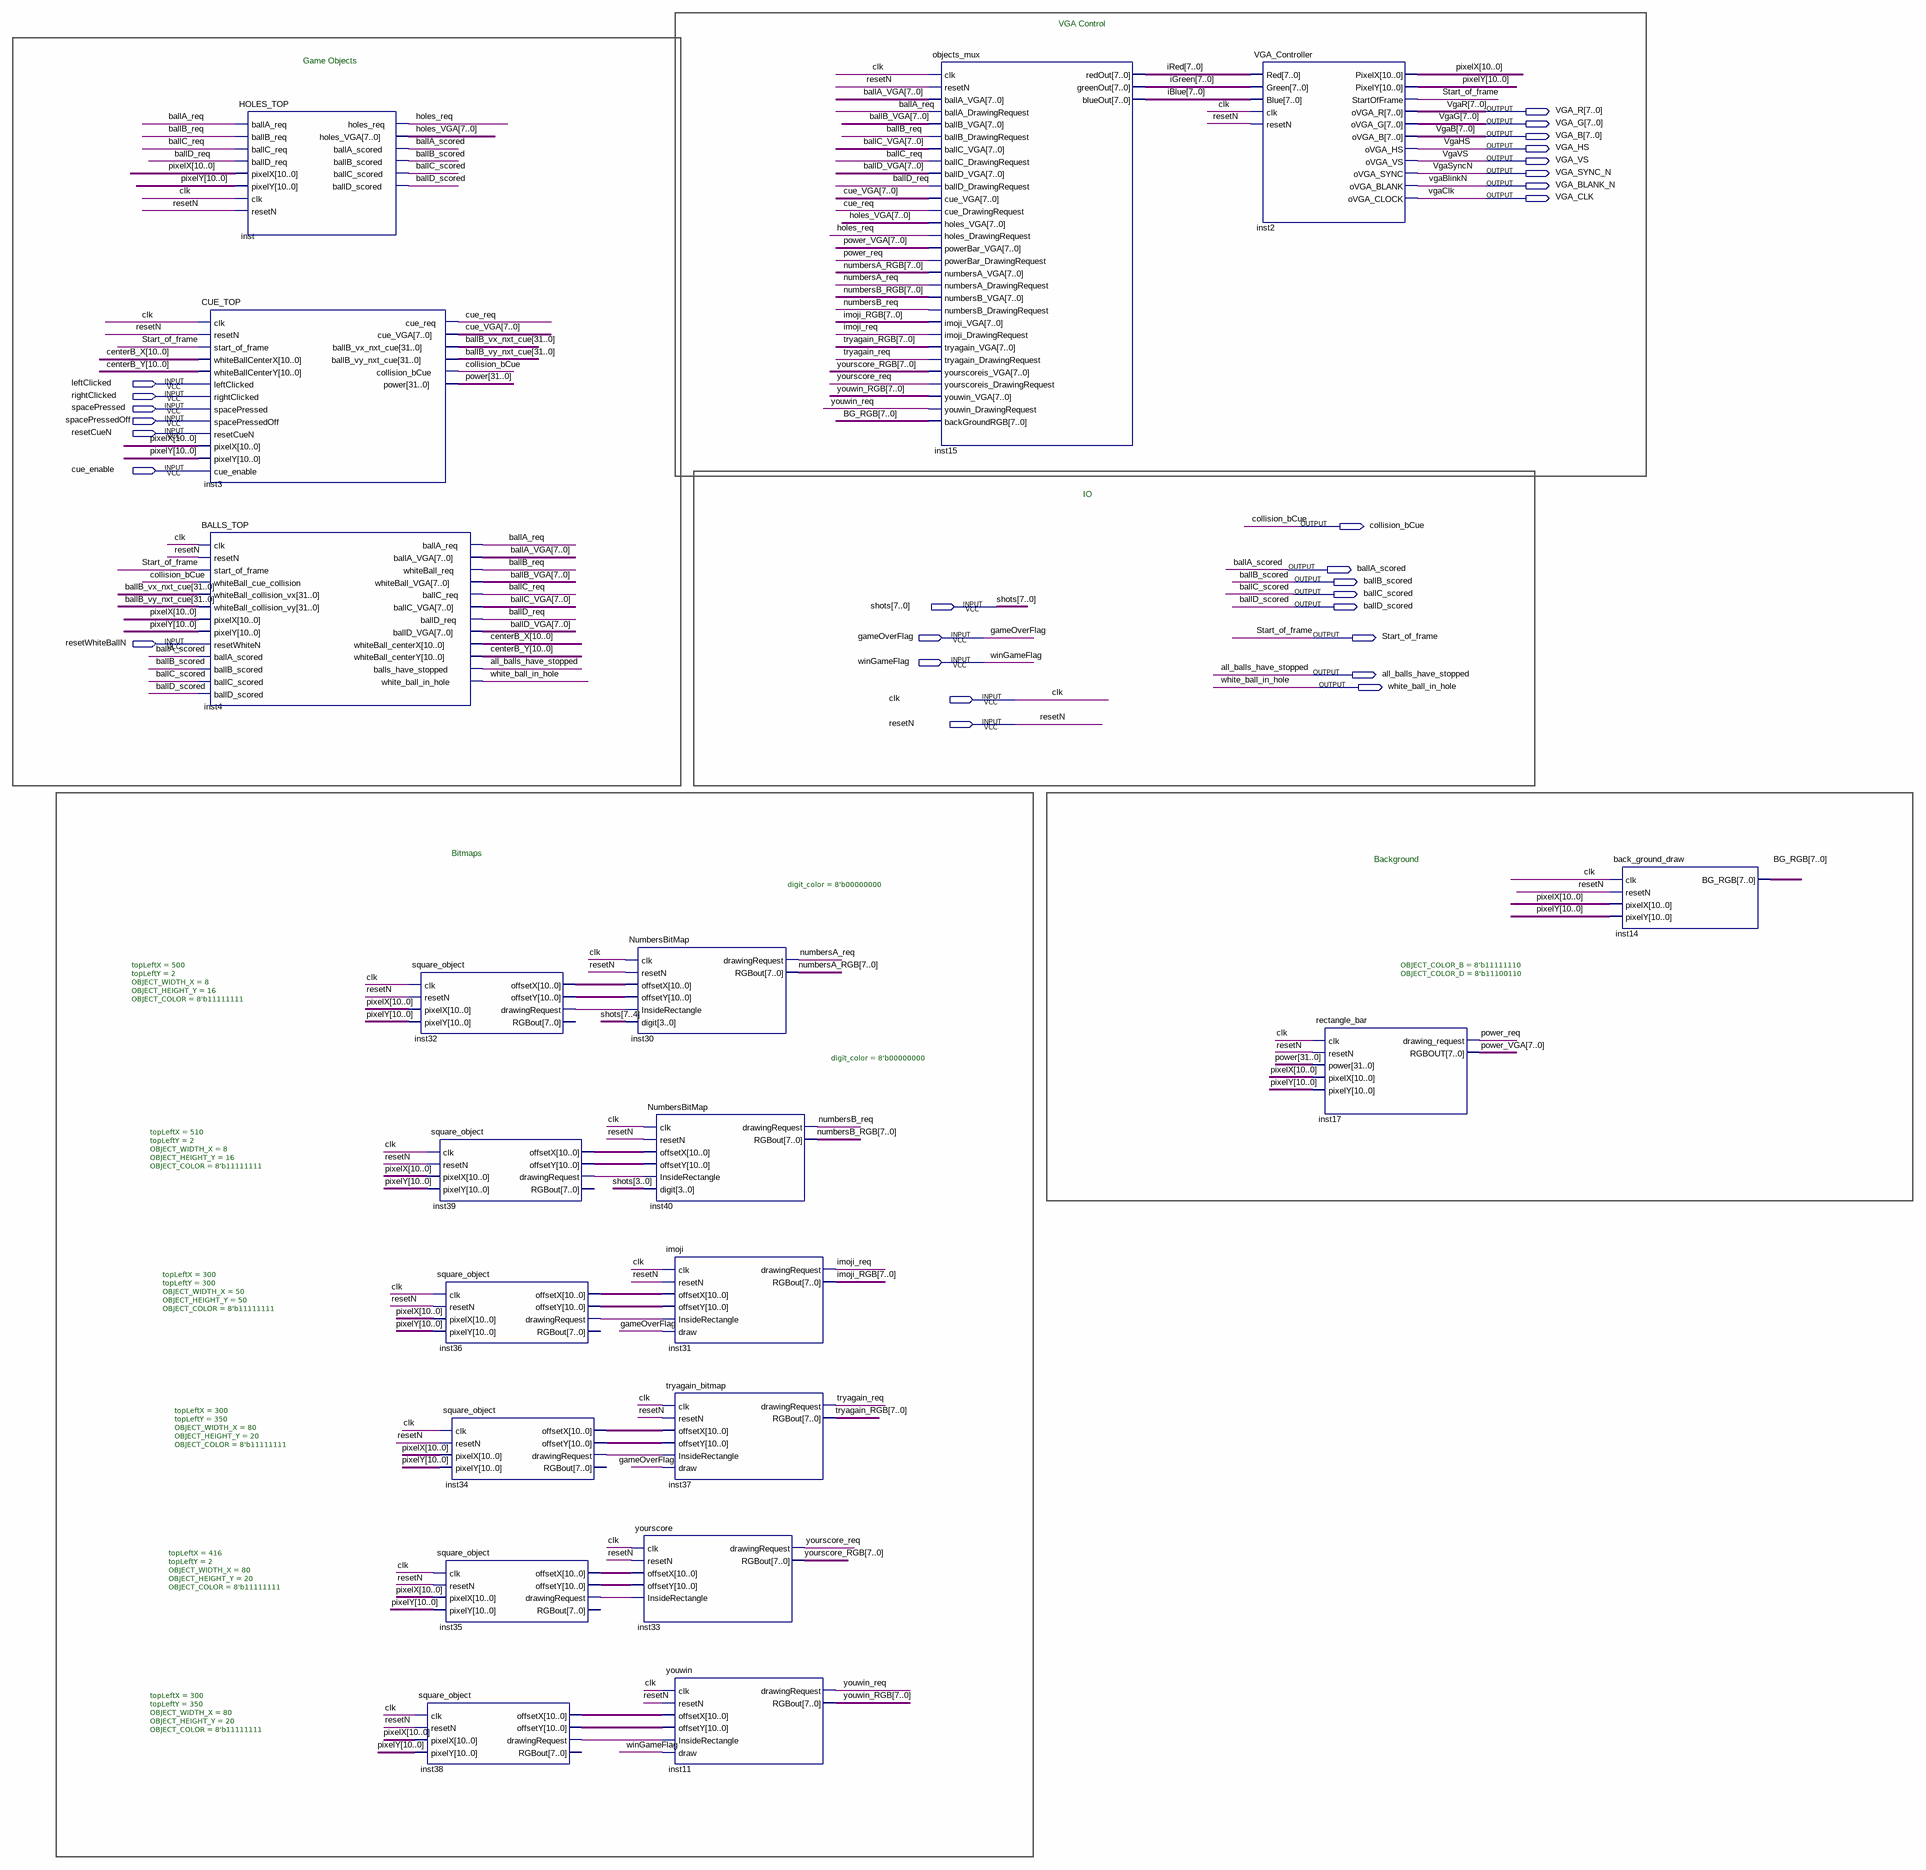
[diagram p0: schematic sheet]
// Quartus schematic VGA_TOP.bdf as structural Verilog: 19 symbols, 28 pins
module VGA_TOP (
  input  leftClicked,
  input  rightClicked,
  input  spacePressed,
  input  spacePressedOff,
  input  resetCueN,
  input  cue_enable,
  input  [7:0] shots,
  input  gameOverFlag,
  input  resetWhiteBallN,
  input  winGameFlag,
  input  clk,
  input  resetN,
  output [7:0] VGA_R,
  output [7:0] VGA_G,
  output [7:0] VGA_B,
  output VGA_HS,
  output VGA_VS,
  output VGA_SYNC_N,
  output VGA_BLANK_N,
  output VGA_CLK,
  output collision_bCue,
  output ballA_scored,
  output ballB_scored,
  output ballC_scored,
  output ballD_scored,
  output Start_of_frame,
  output all_balls_have_stopped,
  output white_ball_in_hole
);

  wire ballA_req, ballB_req, ballC_req, ballD_req, cue_req, holes_req, imoji_req, inst32_drawingrequest,
       inst34_drawingrequest, inst35_drawingrequest, inst36_drawingrequest, inst38_drawingrequest,
       inst39_drawingrequest, numbersA_req, numbersB_req, power_req, tryagain_req, yourscore_req, youwin_req;
  wire [7:0] ballA_VGA, ballB_VGA, ballC_VGA, ballD_VGA, BG_RGB, cue_VGA, holes_VGA, iBlue, iGreen,
       imoji_RGB, iRed, numbersA_RGB, numbersB_RGB, power_VGA, tryagain_RGB, yourscore_RGB, youwin_RGB;
  wire [10:0] centerB_X, centerB_Y, inst32_offsetx, inst32_offsety, inst34_offsetx, inst34_offsety,
       inst35_offsetx, inst35_offsety, inst36_offsetx, inst36_offsety, inst38_offsetx, inst38_offsety,
       inst39_offsetx, inst39_offsety, pixelX, pixelY;
  wire [31:0] ballB_vx_nxt_cue, ballB_vy_nxt_cue, power;

  CUE_TOP inst3 (
    .clk(clk), .resetN(resetN), .start_of_frame(Start_of_frame), .whiteBallCenterX(centerB_X),
    .whiteBallCenterY(centerB_Y), .leftClicked(leftClicked), .rightClicked(rightClicked),
    .spacePressed(spacePressed), .spacePressedOff(spacePressedOff), .resetCueN(resetCueN), .pixelX(pixelX),
    .pixelY(pixelY), .cue_enable(cue_enable), .cue_req(cue_req), .cue_VGA(cue_VGA),
    .ballB_vx_nxt_cue(ballB_vx_nxt_cue), .ballB_vy_nxt_cue(ballB_vy_nxt_cue),
    .collision_bCue(collision_bCue), .power(power));
  BALLS_TOP inst4 (
    .clk(clk), .resetN(resetN), .start_of_frame(Start_of_frame), .whiteBall_cue_collision(collision_bCue),
    .whiteBall_collision_vx(ballB_vx_nxt_cue), .whiteBall_collision_vy(ballB_vy_nxt_cue), .pixelX(pixelX),
    .pixelY(pixelY), .resetWhiteN(resetWhiteBallN), .ballA_scored(ballA_scored), .ballB_scored(ballB_scored),
    .ballC_scored(ballC_scored), .ballD_scored(ballD_scored), .ballA_req(ballA_req), .ballA_VGA(ballA_VGA),
    .whiteBall_req(ballB_req), .whiteBall_VGA(ballB_VGA), .ballC_req(ballC_req), .ballC_VGA(ballC_VGA),
    .ballD_req(ballD_req), .ballD_VGA(ballD_VGA), .whiteBall_centerX(centerB_X),
    .whiteBall_centerY(centerB_Y), .balls_have_stopped(all_balls_have_stopped),
    .white_ball_in_hole(white_ball_in_hole));
  HOLES_TOP inst (
    .ballA_req(ballA_req), .ballB_req(ballB_req), .ballC_req(ballC_req), .ballD_req(ballD_req),
    .pixelX(pixelX), .pixelY(pixelY), .clk(clk), .resetN(resetN), .holes_req(holes_req),
    .holes_VGA(holes_VGA), .ballA_scored(ballA_scored), .ballB_scored(ballB_scored),
    .ballC_scored(ballC_scored), .ballD_scored(ballD_scored));
  square_object #(.topLeftX(500), .topLeftY(2), .OBJECT_WIDTH_X(8), .OBJECT_HEIGHT_Y(16), .OBJECT_COLOR(8'b11111111)) inst32 (
    .clk(clk), .resetN(resetN), .pixelX(pixelX), .pixelY(pixelY), .offsetX(inst32_offsetx),
    .offsetY(inst32_offsety), .drawingRequest(inst32_drawingrequest));  // open: RGBout
  square_object #(.topLeftX(300), .topLeftY(350), .OBJECT_WIDTH_X(80), .OBJECT_HEIGHT_Y(20), .OBJECT_COLOR(8'b11111111)) inst38 (
    .clk(clk), .resetN(resetN), .pixelX(pixelX), .pixelY(pixelY), .offsetX(inst38_offsetx),
    .offsetY(inst38_offsety), .drawingRequest(inst38_drawingrequest));  // open: RGBout
  square_object #(.topLeftX(510), .topLeftY(2), .OBJECT_WIDTH_X(8), .OBJECT_HEIGHT_Y(16), .OBJECT_COLOR(8'b11111111)) inst39 (
    .clk(clk), .resetN(resetN), .pixelX(pixelX), .pixelY(pixelY), .offsetX(inst39_offsetx),
    .offsetY(inst39_offsety), .drawingRequest(inst39_drawingrequest));  // open: RGBout
  square_object #(.topLeftX(300), .topLeftY(300), .OBJECT_WIDTH_X(50), .OBJECT_HEIGHT_Y(50), .OBJECT_COLOR(8'b11111111)) inst36 (
    .clk(clk), .resetN(resetN), .pixelX(pixelX), .pixelY(pixelY), .offsetX(inst36_offsetx),
    .offsetY(inst36_offsety), .drawingRequest(inst36_drawingrequest));  // open: RGBout
  square_object #(.topLeftX(300), .topLeftY(350), .OBJECT_WIDTH_X(80), .OBJECT_HEIGHT_Y(20), .OBJECT_COLOR(8'b11111111)) inst34 (
    .clk(clk), .resetN(resetN), .pixelX(pixelX), .pixelY(pixelY), .offsetX(inst34_offsetx),
    .offsetY(inst34_offsety), .drawingRequest(inst34_drawingrequest));  // open: RGBout
  square_object #(.topLeftX(416), .topLeftY(2), .OBJECT_WIDTH_X(80), .OBJECT_HEIGHT_Y(20), .OBJECT_COLOR(8'b11111111)) inst35 (
    .clk(clk), .resetN(resetN), .pixelX(pixelX), .pixelY(pixelY), .offsetX(inst35_offsetx),
    .offsetY(inst35_offsety), .drawingRequest(inst35_drawingrequest));  // open: RGBout
  NumbersBitMap #(.digit_color(8'b00000000)) inst30 (
    .clk(clk), .resetN(resetN), .offsetX(inst32_offsetx), .offsetY(inst32_offsety),
    .InsideRectangle(inst32_drawingrequest), .digit(shots[7:4]), .drawingRequest(numbersA_req),
    .RGBout(numbersA_RGB));
  NumbersBitMap #(.digit_color(8'b00000000)) inst40 (
    .clk(clk), .resetN(resetN), .offsetX(inst39_offsetx), .offsetY(inst39_offsety),
    .InsideRectangle(inst39_drawingrequest), .digit(shots[3:0]), .drawingRequest(numbersB_req),
    .RGBout(numbersB_RGB));
  imoji inst31 (
    .clk(clk), .resetN(resetN), .offsetX(inst36_offsetx), .offsetY(inst36_offsety),
    .InsideRectangle(inst36_drawingrequest), .draw(gameOverFlag), .drawingRequest(imoji_req),
    .RGBout(imoji_RGB));
  tryagain_bitmap inst37 (
    .clk(clk), .resetN(resetN), .offsetX(inst34_offsetx), .offsetY(inst34_offsety),
    .InsideRectangle(inst34_drawingrequest), .draw(gameOverFlag), .drawingRequest(tryagain_req),
    .RGBout(tryagain_RGB));
  yourscore inst33 (
    .clk(clk), .resetN(resetN), .offsetX(inst35_offsetx), .offsetY(inst35_offsety),
    .InsideRectangle(inst35_drawingrequest), .drawingRequest(yourscore_req), .RGBout(yourscore_RGB));
  youwin inst11 (
    .clk(clk), .resetN(resetN), .offsetX(inst38_offsetx), .offsetY(inst38_offsety),
    .InsideRectangle(inst38_drawingrequest), .draw(winGameFlag), .drawingRequest(youwin_req),
    .RGBout(youwin_RGB));
  objects_mux inst15 (
    .clk(clk), .resetN(resetN), .ballA_VGA(ballA_VGA), .ballA_DrawingRequest(ballA_req),
    .ballB_VGA(ballB_VGA), .ballB_DrawingRequest(ballB_req), .ballC_VGA(ballC_VGA),
    .ballC_DrawingRequest(ballC_req), .ballD_VGA(ballD_VGA), .ballD_DrawingRequest(ballD_req),
    .cue_VGA(cue_VGA), .cue_DrawingRequest(cue_req), .holes_VGA(holes_VGA), .holes_DrawingRequest(holes_req),
    .powerBar_VGA(power_VGA), .powerBar_DrawingRequest(power_req), .numbersA_VGA(numbersA_RGB),
    .numbersA_DrawingRequest(numbersA_req), .numbersB_VGA(numbersB_RGB),
    .numbersB_DrawingRequest(numbersB_req), .imoji_VGA(imoji_RGB), .imoji_DrawingRequest(imoji_req),
    .tryagain_VGA(tryagain_RGB), .tryagain_DrawingRequest(tryagain_req), .yourscoreis_VGA(yourscore_RGB),
    .yourscoreis_DrawingRequest(yourscore_req), .youwin_VGA(youwin_RGB), .youwin_DrawingRequest(youwin_req),
    .backGroundRGB(BG_RGB), .redOut(iRed), .greenOut(iGreen), .blueOut(iBlue));
  VGA_Controller inst2 (
    .Red(iRed), .Green(iGreen), .Blue(iBlue), .clk(clk), .resetN(resetN), .PixelX(pixelX), .PixelY(pixelY),
    .StartOfFrame(Start_of_frame), .oVGA_R(VGA_R), .oVGA_G(VGA_G), .oVGA_B(VGA_B), .oVGA_HS(VGA_HS),
    .oVGA_VS(VGA_VS), .oVGA_SYNC(VGA_SYNC_N), .oVGA_BLANK(VGA_BLANK_N), .oVGA_CLOCK(VGA_CLK));
  rectangle_bar #(.OBJECT_COLOR_B(8'b11111110), .OBJECT_COLOR_D(8'b11100110)) inst17 (
    .clk(clk), .resetN(resetN), .power(power), .pixelX(pixelX), .pixelY(pixelY), .drawing_request(power_req),
    .RGBOUT(power_VGA));
  back_ground_draw inst14 (.clk(clk), .resetN(resetN), .pixelX(pixelX), .pixelY(pixelY), .BG_RGB(BG_RGB));

  // Other names for the same wires on the sheet: VgaB[7:0] = VGA_B; vgaBlinkN = VGA_BLANK_N; vgaClk = VGA_CLK;
  //   VgaG[7:0] = VGA_G; VgaHS = VGA_HS; VgaR[7:0] = VGA_R; VgaSyncN = VGA_SYNC_N; VgaVS = VGA_VS

  // Notes on the sheet:
  //   VGA Control
  //   Game Objects
  //   IO
  //   Bitmaps
  //   Background
endmodule
